# Altium project BY-IOM-v0.2.PrjPCB
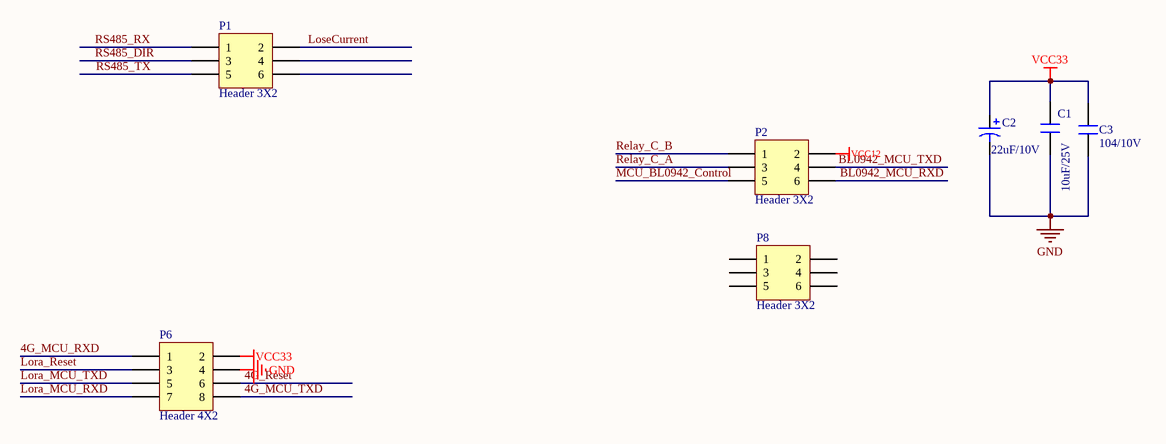
[diagram p0: 连接.SchDoc]
2 sheets, 41 parts. Net scope: global (net labels, ports and power ports of the same name join across sheets).
Board file: Power.PcbDoc
Sheets:
  连接.SchDoc
  MCU.SchDoc

## Sheet 连接.SchDoc
size A4

### Parts
C1  10uF/25V  [0603R]
C2  22uF/10V  [0805R]
C3  104/10V  [0603R]
P1  Header 3X2  [CONN-SMD_5BME8-08872-203-W0]
P2  Header 3X2  [CONN-SMD_5BME8-08872-203-W0]
P6  Header 4X2  [CONN-SMD_5BME8-08872-204-W0]
P8  Header 3X2  [CONN-SMD_5BME8-08872-203-W0]

### Nets
GND: C1.1 C2.2 C3.1 P6.4
VCC12: P2.2
VCC33: C1.2 C2.1 C3.2 P6.2
4G_MCU_RXD: P6.1
4G_MCU_TXD: P6.8
4G_Reset: P6.6
BL0942_MCU_RXD: P2.6
BL0942_MCU_TXD: P2.4
Lora_MCU_RXD: P6.7
Lora_MCU_TXD: P6.5
Lora_Reset: P6.3
LoseCurrent: P1.2
MCU_BL0942_Control: P2.5
Relay_C_A: P2.3
Relay_C_B: P2.1
RS485_DIR: P1.3
RS485_RX: P1.1
RS485_TX: P1.5

Not connected (* = marked no-connect by the designer): P1 4 6; P8 1 2 3 4 5 6

### Library data of the parts
C1 = CAP
C2 = Cap Pol1: Polarized Capacitor (Radial); Published: 8-Jun-2000; LatestRevisionDate: 17-Jul-2002; LatestRevisionNote: Re-released for DXP Platform.; PackageReference: RB7.6-15; Publisher: Altium Limited; PackageDescription: Polarized Capacitor (Radial); 2 Leads
C3 = CAP_1
P1 P2 P8 = Header 3X2: Header, 3-Pin, Dual row; LatestRevisionDate: 17-Jul-2002; LatestRevisionNote: Re-released for DXP Platform.; Publisher: Altium Limited
P6 = Header 4X2: Header, 4-Pin, Dual row; LatestRevisionDate: 17-Jul-2002; LatestRevisionNote: Re-released for DXP Platform.; Publisher: Altium Limited

## Sheet MCU.SchDoc
size A4
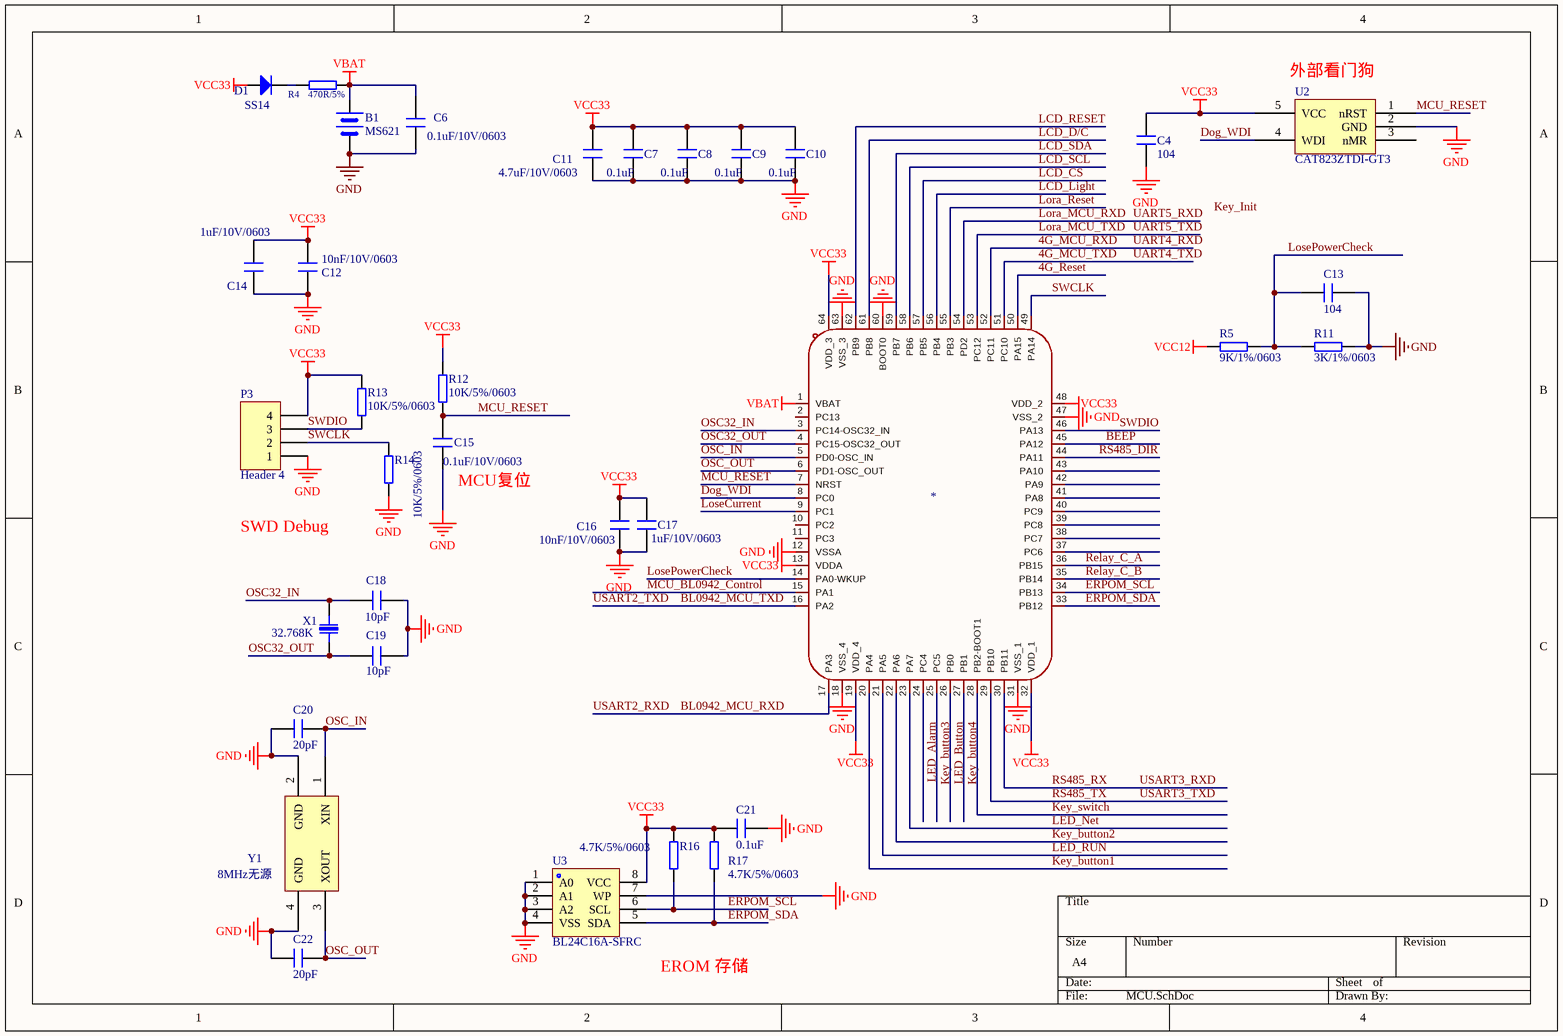
[diagram p1: MCU.SchDoc]

### Parts
B1  MS621  [MS621]
C4  104  [0603R]
C6  0.1uF/10V/0603  [0603R]
C7  0.1uF  [0603R]
C8  0.1uF  [0603R]
C9  0.1uF  [0603R]
C10  0.1uF  [0603R]
C11  4.7uF/10V/0603  [0603R]
C12  10nF/10V/0603  [0603R]
C13  104  [0603R]
C14  1uF/10V/0603  [0603R]
C15  0.1uF/10V/0603  [0603R]
C16  10nF/10V/0603  [0603R]
C17  1uF/10V/0603  [0603R]
C18  10pF  [0603r]
C19  10pF  [0603r]
C20  20pF  [0603r]
C21  0.1uF  [0603R]
C22  20pF  [0603r]
D1  SS14  [SOD323]
P3  Header 4  [HDR1X4]
R4  470R/5%  [0603R]
R5  9K/1%/0603  [0603R]
R11  3K/1%/0603  [0603R]
R12  10K/5%/0603  [0603r]
R13  10K/5%/0603  [0603r]
R14  10K/5%/0603  [0603r]
R16  4.7K/5%/0603  [0603R]
R17  4.7K/5%/0603  [0603R]
U1  *  [LQFP64]
U2  CAT823ZTDI-GT3  [SOT-23-5]
U3  BL24C16A-SFRC  [TSSOP8]
X1  32.768K  [Y3215]
Y1  8MHz无源  [3225]

### Nets
GND: B1.2 C4.1 C6.1 C7.1 C8.1 C9.1 C10.1 C11.1 C12.1 C13.1 C14.1 C15.1 C16.1 C17.1 C18.2 C19.1 C20.1 C21.1 C22.1 P3.1 R11.1 R14.1 U1.12(VSSA) U1.18(VSS_4) U1.31(VSS_1) U1.47(VSS_2) U1.60(BOOT0) U1.63(VSS_3) U2.2(GND) U3.1(A0) U3.2(A1) U3.3(A2) U3.4(VSS) U3.7(WP) Y1.2(GND) Y1.4(GND)
VBAT: B1.1 C6.2 R4.1 U1.1(VBAT)
VCC12: R5.1
VCC33: C4.2 C7.2 C8.2 C9.2 C10.2 C11.2 C12.2 C14.2 C16.2 C17.2 C21.2 D1.2(A) P3.4 R12.2 R13.2 R16.1 R17.1 U1.13(VDDA) U1.19(VDD_4) U1.32(VDD_1) U1.48(VDD_2) U1.64(VDD_3) U2.5(VCC) U3.8(VCC)
4G_MCU_RXD: U1.52(PC11)  [also labelled UART4_RXD]
4G_MCU_TXD: U1.51(PC10)  [also labelled UART4_TXD]
4G_Reset: U1.50(PA15)
BEEP: U1.45(PA12)
BL0942_MCU_RXD: U1.17(PA3)  [also labelled USART2_RXD]
BL0942_MCU_TXD: U1.16(PA2)  [also labelled USART2_TXD]
Dog_WDI: U1.8(PC0) U2.4(WDI)
ERPOM_SCL: R16.2 U1.34(PB13) U3.6(SCL)
ERPOM_SDA: R17.2 U1.33(PB12) U3.5(SDA)
Key_button1: U1.20(PA4)
Key_button2: U1.22(PA6)
Key_button3: U1.25(PC5)
Key_button4: U1.27(PB1)
Key_switch: U1.28(PB2-BOOT1)
LCD_CS: U1.57(PB5)
LCD_D/C: U1.61(PB8)
LCD_Light: U1.56(PB4)
LCD_RESET: U1.62(PB9)
LCD_SCL: U1.58(PB6)
LCD_SDA: U1.59(PB7)
LED_Alarm: U1.24(PC4)
LED_Button: U1.26(PB0)
LED_Net: U1.23(PA7)
LED_RUN: U1.21(PA5)
Lora_MCU_RXD: U1.54(PD2)  [also labelled UART5_RXD]
Lora_MCU_TXD: U1.53(PC12)  [also labelled UART5_TXD]
Lora_Reset: U1.55(PB3)
LoseCurrent: U1.9(PC1)
LosePowerCheck: C13.2 R5.2 R11.2 U1.14(PA0-WKUP)
MCU_BL0942_Control: U1.15(PA1)
MCU_RESET: C15.2 R12.1 U1.7(NRST) U2.1(nRST)
OSC32_IN: C18.1 U1.3(PC14-OSC32_IN) X1.2
OSC32_OUT: C19.2 U1.4(PC15-OSC32_OUT) X1.1
OSC_IN: C20.2 U1.5(PD0-OSC_IN) Y1.1(XIN)
OSC_OUT: C22.2 U1.6(PD1-OSC_OUT) Y1.3(XOUT)
Relay_C_A: U1.36(PB15)
Relay_C_B: U1.35(PB14)
RS485_DIR: U1.44(PA11)
RS485_RX: U1.30(PB11)  [also labelled USART3_RXD]
RS485_TX: U1.29(PB10)  [also labelled USART3_TXD]
SWCLK: P3.2 R14.2 U1.49(PA14)
SWDIO: P3.3 R13.1 U1.46(PA13)
NetD1_1: D1.1(K) R4.2

Not connected (* = marked no-connect by the designer): U1 2(PC13) 10(PC2) 11(PC3) 37(PC6) 38(PC7) 39(PC8) 40(PC9) 41(PA8) 42(PA9) 43(PA10); U2 3(nMR)

### Notes on the sheet
- (near U2) 外部看门狗
- (near C15) MCU复位
- SWD Debug
- (near U3) EROM 存储
- Labels drawn without touching a wire or pin: Key_Init

### Library data of the parts
B1 = BATTERY
C4 C13 C18-C20 C22 = CAP
C6-C12 C14-C17 C21 = CAP_1
D1 = DIODE
P3 = Header 4: Header, 4-Pin; LatestRevisionDate: 17-Jul-2002; LatestRevisionNote: Re-released for DXP Platform.; Publisher: Altium Limited
R4 R5 R11-R14 R16 R17 = RES
U1 = N32G452REL7: Symbol: N32G452REL7
U2 = CAT823
U3 = 24LC02
X1 = XTAL
Y1 = 12MHz无源

## Nets that join several sheets
GND: 连接 (C1.1 C2.2 C3.1 P6.4), MCU (36 pins)
VCC12: 连接 (P2.2), MCU (R5.1)
VCC33: 连接 (C1.2 C2.1 C3.2 P6.2), MCU (24 pins)
4G_MCU_RXD: 连接 (P6.1), MCU (U1.52)
4G_MCU_TXD: 连接 (P6.8), MCU (U1.51)
4G_Reset: 连接 (P6.6), MCU (U1.50)
BL0942_MCU_RXD: 连接 (P2.6), MCU (U1.17)
BL0942_MCU_TXD: 连接 (P2.4), MCU (U1.16)
Lora_MCU_RXD: 连接 (P6.7), MCU (U1.54)
Lora_MCU_TXD: 连接 (P6.5), MCU (U1.53)
Lora_Reset: 连接 (P6.3), MCU (U1.55)
LoseCurrent: 连接 (P1.2), MCU (U1.9)
MCU_BL0942_Control: 连接 (P2.5), MCU (U1.15)
Relay_C_A: 连接 (P2.3), MCU (U1.36)
Relay_C_B: 连接 (P2.1), MCU (U1.35)
RS485_DIR: 连接 (P1.3), MCU (U1.44)
RS485_RX: 连接 (P1.1), MCU (U1.30)
RS485_TX: 连接 (P1.5), MCU (U1.29)